# EasyEDA schematic Pocket_Simon_Schematic.json
TITLE: Pocket Simon; REV: 1.0; Date: 2021-09-23; Sheet: 1/1; Drawn By: anthonyramos12898; Company: AnthoTRONICS
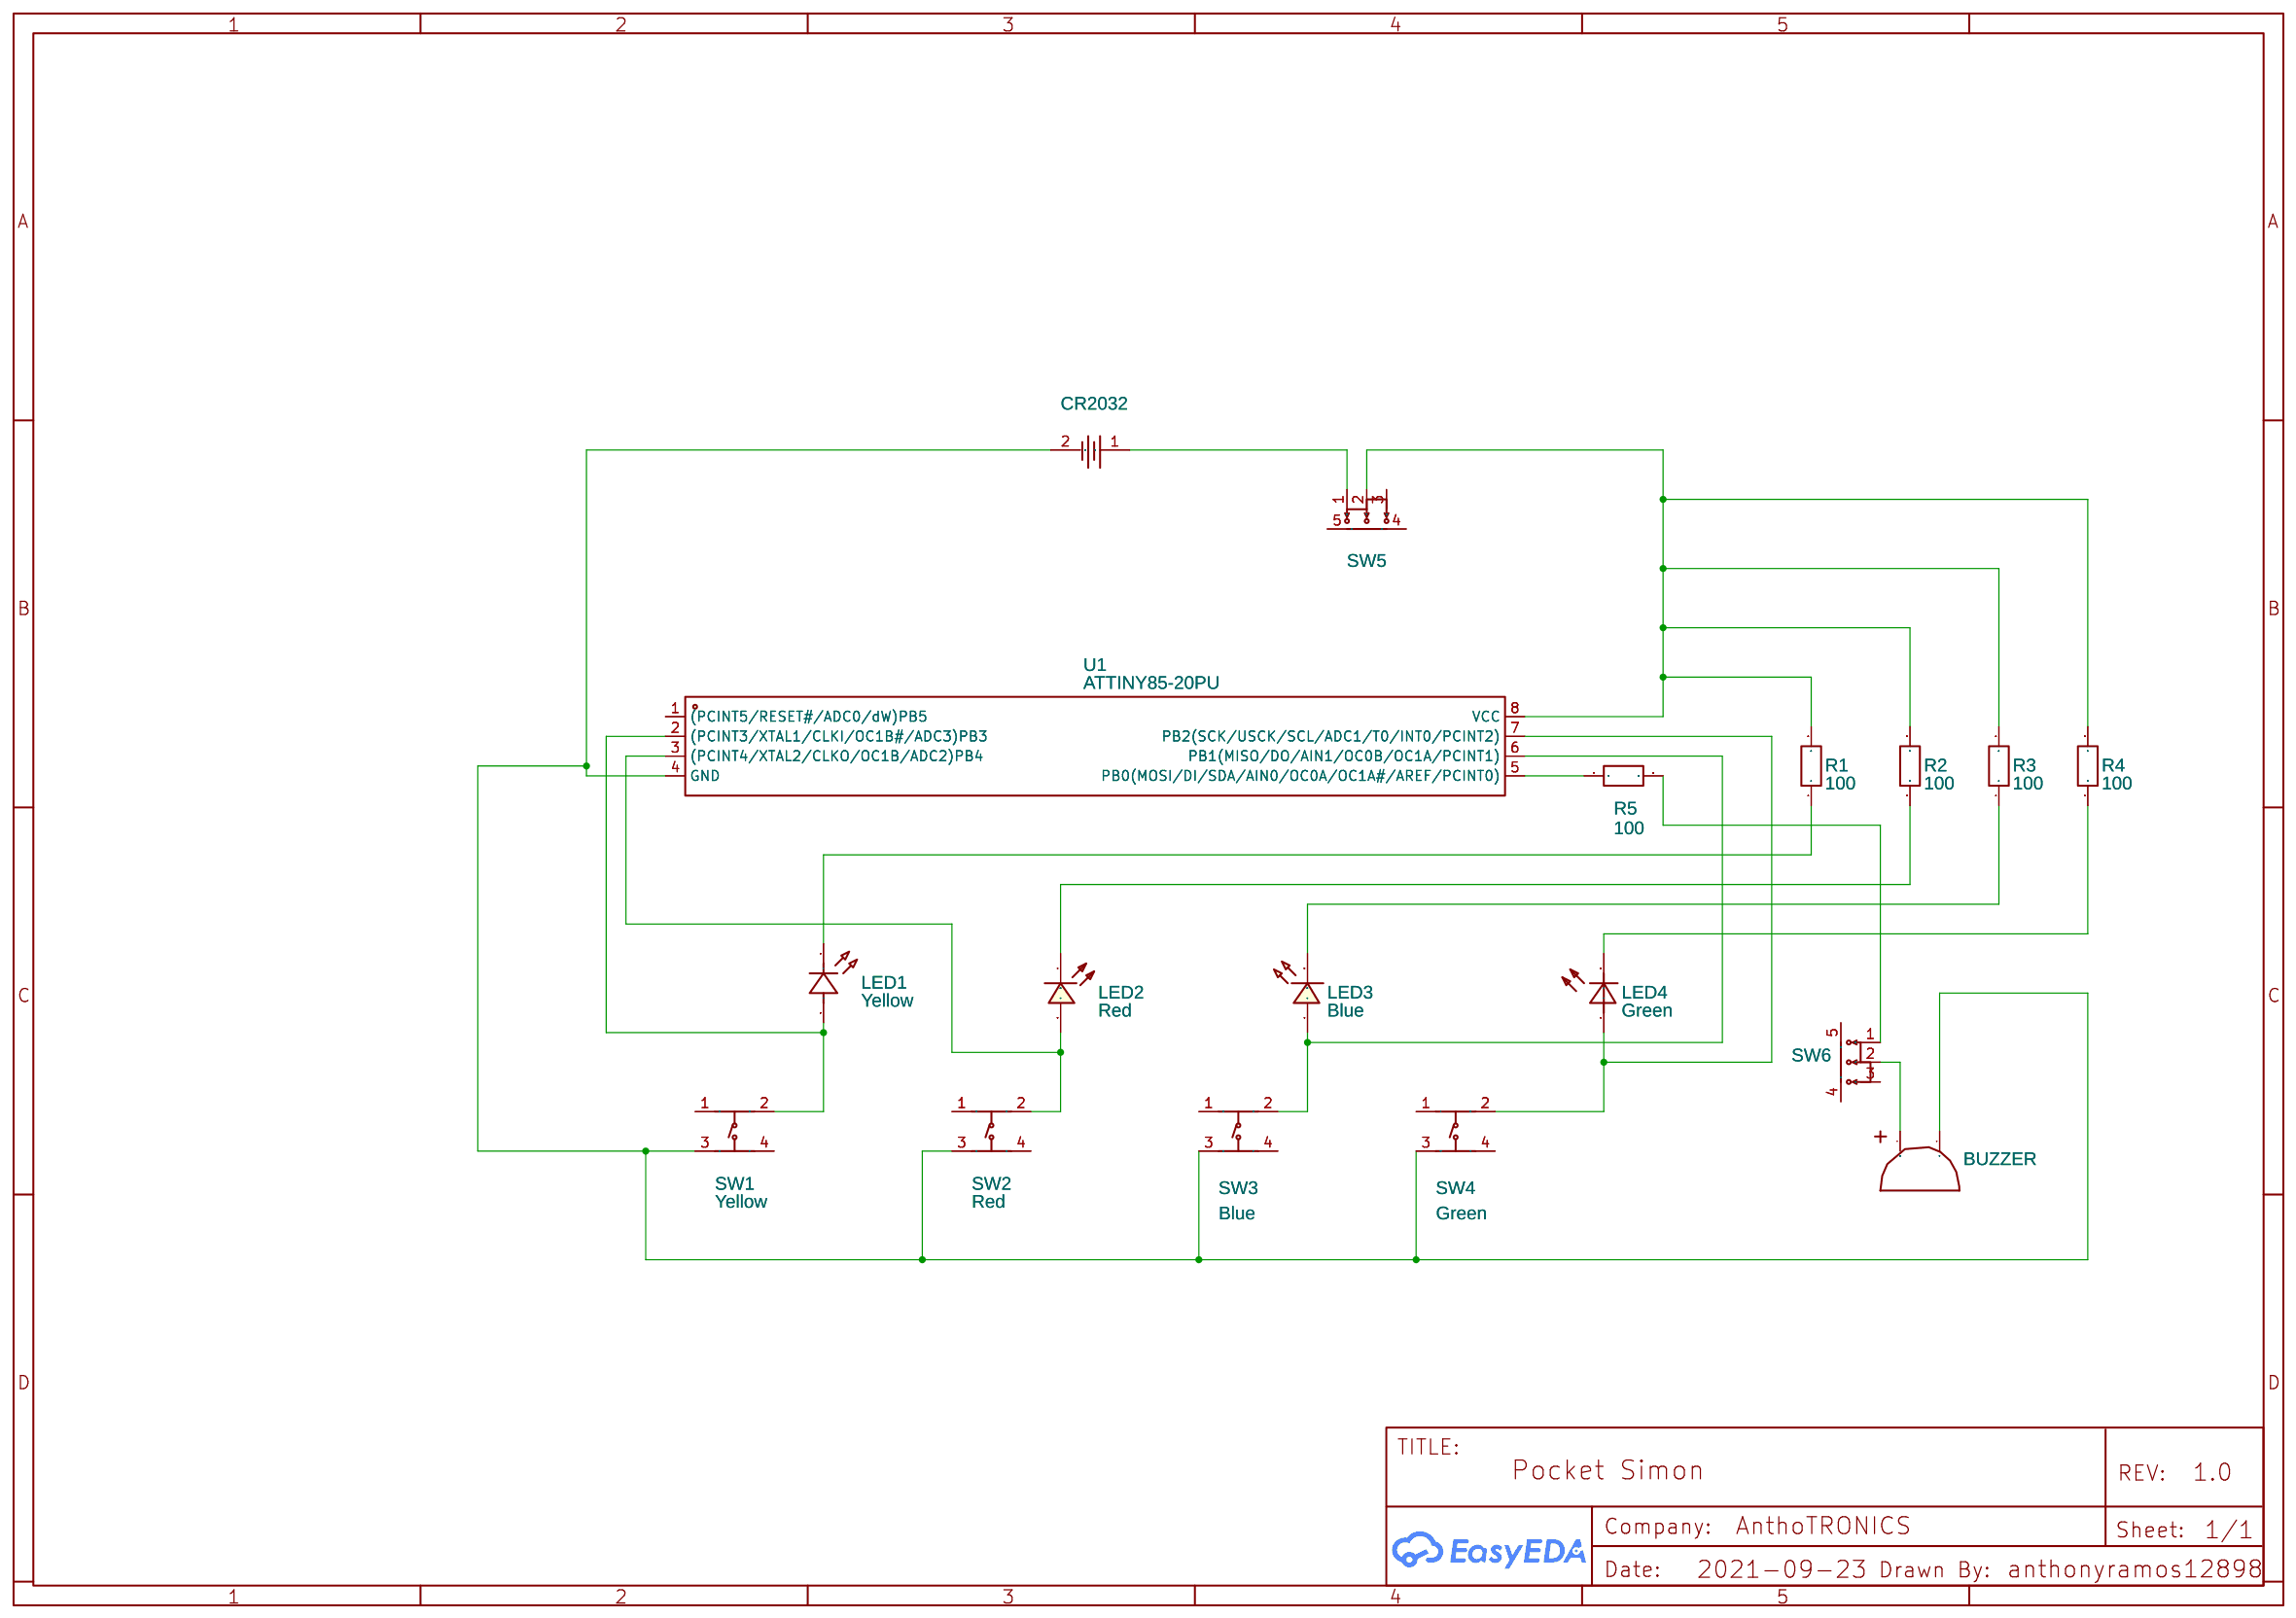
[diagram p0: schematic sheet]

## Parts
BUZZER  BUZZER  [BUZZER-12MM-KIT]
CR2032  BS-23-A1AK001  [BAT-TH_BS-23-A1AK001]
LED1  Yellow  [LED-TH_BD5.9-P2.54-RD_YELLOW]
LED2  Red  [LED-TH_BD5.9-P2.54-RD_RED]
LED3  Blue  [LED-TH_BD5.0_BLUE]
LED4  Green  [LED 5MM GREEN]
R1  100  [RES-TH_BD2.2-L6.5-P10.50-D0.6]
R2  100  [RES-TH_BD2.2-L6.5-P10.50-D0.6]
R3  100  [RES-TH_BD2.2-L6.5-P10.50-D0.6]
R4  100  [RES-TH_BD2.2-L6.5-P10.50-D0.6]
R5  100  [RES-TH_BD2.2-L6.5-P10.50-D0.6]
SW1  Yellow  [SW-TH_4P-L12.0-W12.0-P5.00-LS12.5]
SW2  Red  [SW-TH_4P-L12.0-W12.0-P5.00-LS12.5]
SW3  Blue  [SW-TH_4P-L12.0-W12.0-P5.00-LS12.5]
SW4  Green  [SW-TH_4P-L12.0-W12.0-P5.00-LS12.5]
SW5  SS-12D02-G3  [SW-TH_SS-12D02-G3]
SW6  SS-12D02-G3  [SW-TH_SS-12D02-G3]
U1  ATTINY85-20PU  [PDIP-8_L9.3-W6.4-P2.54-LS7.6-BL]

## Library data of the parts
BUZZER = BUZZER: Contributor: SparkFun
CR2032 = BS-23-A1AK001: Supplier: LCSC; Supplier Part: C964803; Manufacturer: MYOUNG(美阳); Contributor: LCSC; JLCPCB Part Class: Extended Part
LED1 = TZ-L2-05YYBY1YCJ30-001: Supplier: LCSC; Supplier Part: C779441; Manufacturer: TUOZHAN; Contributor: LCSC
LED2 = 333-2SDRD/S530-A3-L: Supplier: LCSC; Supplier Part: C409526; Manufacturer: Everlight Elec; Contributor: LCSC; JLCPCB Part Class: Extended Part
LED3 = LED-TH-5mm_W: Supplier: LCSC; Contributor: Danny591
LED4 = LED AL307 Green: Contributor: Evgen1717
R1-R5 = MFR0W4F150KA50_C66716: Supplier: LCSC; Supplier Part: C66716; Manufacturer: Uniroyal Elec; Manufacturer Part: MFR0W4F150KA50; Contributor: LCSC
SW1-SW4 = TS-KG1103-BB65F: Supplier: LCSC; Supplier Part: C2874457; Manufacturer: 台湾汉博; Contributor: LCSC
SW5 SW6 = SS-12D02-G3: Supplier: LCSC; Supplier Part: C521447; Manufacturer: USAKRO(美韩); Contributor: LCSC; JLCPCB Part Class: Extended Part
U1 = ATTINY85-20PU: Supplier: LCSC; Supplier Part: C965497; Manufacturer: MICROCHIP(美国微芯); Contributor: LCSC

## Nets
Net-(BUZZER-+): BUZZER.+(1) CR2032.2 SW1.3 SW2.3 SW3.3 SW4.3 U1.4(GND)
Net-(BUZZER--): BUZZER.-(2) SW6.2
Net-(CR2032-1): CR2032.1 SW5.1
Net-(LED1-1): LED1.1(-) R1.1
Net-(LED1-2): LED1.2(+) SW1.2 U1.2((PCINT3/XTAL1/CLKI/OC1B#/ADC3)PB3)
Net-(LED2-1): LED2.1(C) R2.1
Net-(LED2-2): LED2.2(A) SW2.2 U1.3((PCINT4/XTAL2/CLKO/OC1B/ADC2)PB4)
Net-(LED3-1): LED3.1 SW3.2 U1.6(PB1(MISO/DO/AIN1/OC0B/OC1A/PCINT1))
Net-(LED3-2): LED3.2 R3.1
Net-(LED4-1): LED4.1(+) SW4.2 U1.7(PB2(SCK/USCK/SCL/ADC1/T0/INT0/PCINT2))
Net-(LED4-2): LED4.2(-) R4.1
Net-(R1-2): R1.2 R2.2 R3.2 R4.2 SW5.2 U1.8(VCC)
Net-(R5-1): R5.1 U1.5(PB0(MOSI/DI/SDA/AIN0/OC0A/OC1A#/AREF/PCINT0))
Net-(R5-2): R5.2 SW6.1

Not connected (* = marked no-connect by the designer): SW1 1 4; SW2 1 4; SW3 1 4; SW4 1 4; SW5 3 4 5; SW6 3 4 5; U1 1((PCINT5/RESET#/ADC0/dW)PB5)
